# EAGLE design Driver (EAGLE 7.6.0)
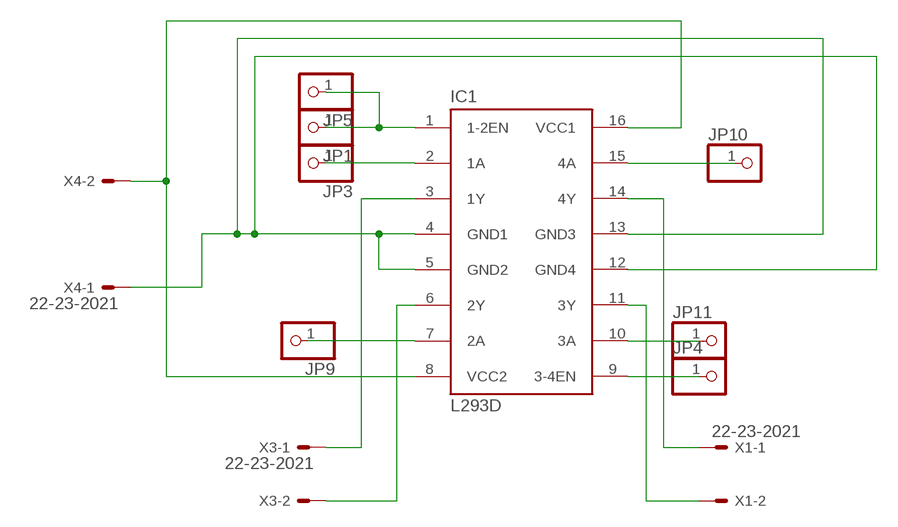
[diagram p0: schematic, sheet 1]

## Parts
IC1  L293D  [DIL16]
JP1  PINHD-1X1  [1X01]
JP3  PINHD-1X1  [1X01]
JP4  PINHD-1X1  [1X01]
JP5  PINHD-1X1  [1X01]
JP9  PINHD-1X1  [1X01]
JP10  PINHD-1X1  [1X01]
JP11  PINHD-1X1  [1X01]
X1  22-23-2021  [22-23-2021]
X3  22-23-2021  [22-23-2021]
X4  22-23-2021  [22-23-2021]

## Nets
N$1: IC1.14(4Y) X1.1
N$2: IC1.1(1-2EN) JP1.1 JP5.1
N$3: IC1.2(1A) JP3.1
N$4: IC1.7(2A) JP9.1
N$5: IC1.10(3A) JP11.1
N$6: IC1.11(3Y) X1.2
N$7: IC1.3(1Y) X3.1
N$8: IC1.6(2Y) X3.2
N$9: IC1.15(4A) JP10.1
N$10: IC1.4(GND1) IC1.5(GND2) IC1.12(GND4) IC1.13(GND3) X4.1
N$12: IC1.8(VCC2) IC1.16(VCC1) X4.2
N$13: IC1.9(3-4EN) JP4.1

## Library data of the parts
IC1 = st-microelectronics:L293D: PUSH-PULL 4 CHANNEL DRIVER; MPN: L293D; OC_FARNELL: 9589619; OC_NEWARK: 56P8249
JP1 JP3-JP5 JP9-JP11 = pinhead:PINHD-1X1: PIN HEADER
X1 X3 X4 = con-molex:22-23-2021: .100" (2.54mm) Center Header - 2 Pin; MF: MOLEX; MPN: 22-23-2021; OC_FARNELL: 1462926; OC_NEWARK: 25C3832

## Board
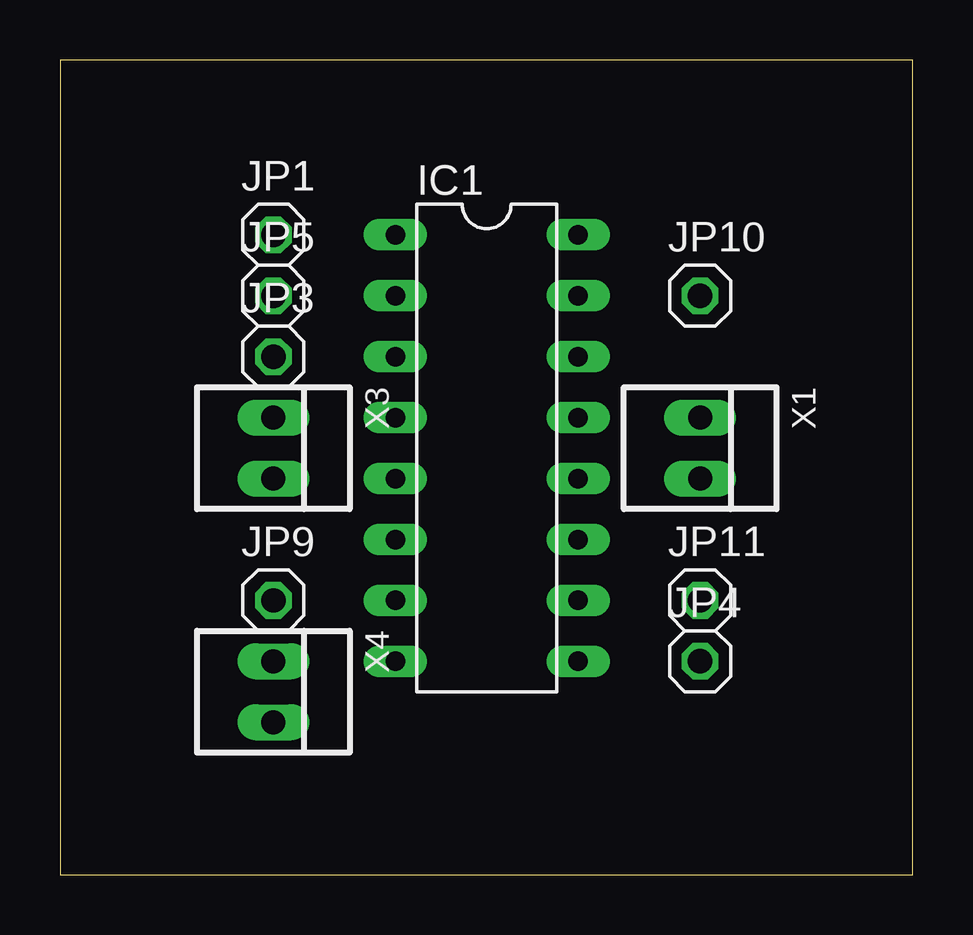
[diagram p1: board, top side]
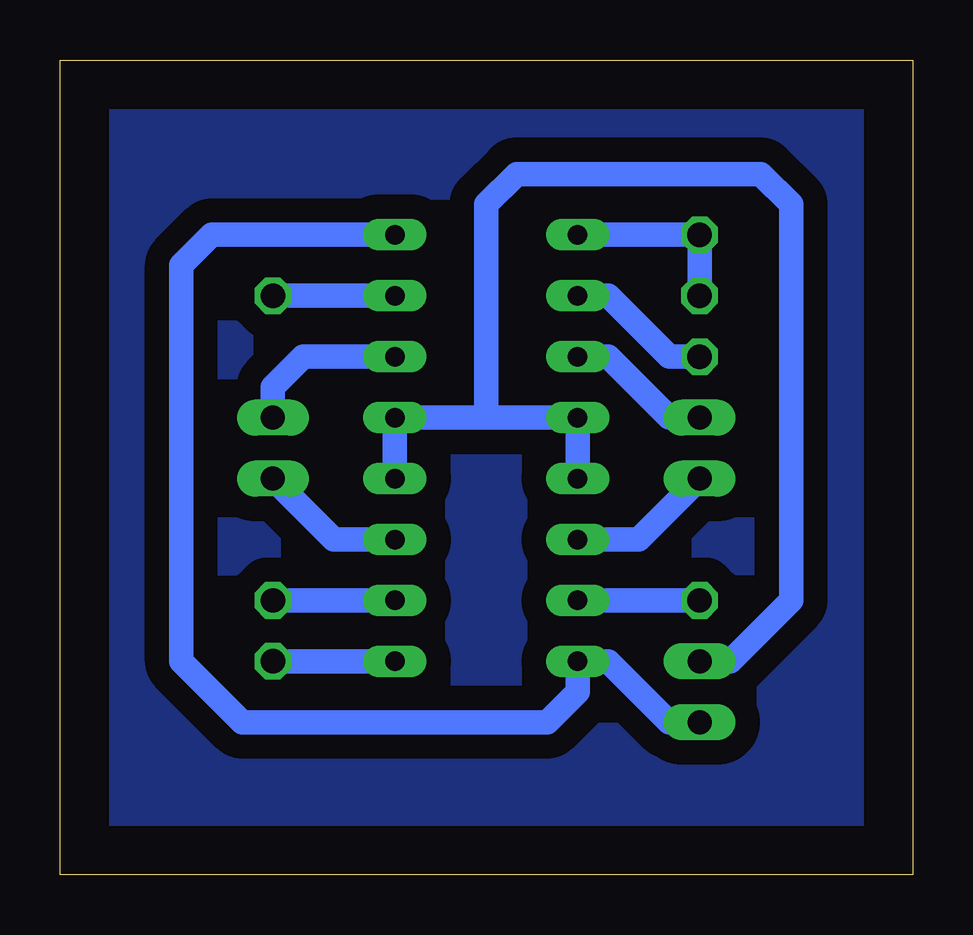
[diagram p2: board, bottom side, seen from below]

Size 35.54 x 33.96 mm. Coordinates in mm from the lower left corner, seen from the top.
Outline: 0,0 35.54,0 35.54,33.96 0,33.96 0,0
Copper layers (1*16): Top 0.035mm / dielectric 1.5mm / Bottom 0.035mm
Design rules "default *": minimum track width 50mil, minimum drill 24mil, track to track 18mil, track to pad 18mil, pad to pad 8mil, via to via 8mil, smd to smd 8mil, copper to edge 80mil, drill to drill 8mil, minimum pad ring 10mil, minimum via ring 8mil, stop-mask expansion 4mil, vias tented up to drill 0mil, thermal gap 10mil

### Footprints (pad centres in the part's own frame; a part is rotated, then mirrored left to right if it is on the bottom)
DIL16 = drill 0.813 long: 1 -8.89,-3.81; 2 -6.35,-3.81; 3 -3.81,-3.81; 4 -1.27,-3.81; 5 1.27,-3.81; 6 3.81,-3.81; 7 6.35,-3.81; 8 8.89,-3.81; 9 8.89,3.81; 10 6.35,3.81; 11 3.81,3.81; 12 1.27,3.81; 13 -1.27,3.81; 14 -3.81,3.81; 15 -6.35,3.81; 16 -8.89,3.81
1X01 = drill 1.016 octagon: 1 0,0
22-23-2021 = drill 1 long: 1 -1.27,0; 2 1.27,0

### Placement (x,y rotation side)
IC1  17.78,17.78 270 top
JP1  8.89,26.67 0 top
JP3  8.89,21.59 0 top
JP4  26.67,8.89 0 top
JP5  8.89,24.13 0 top
JP9  8.89,11.43 0 top
JP10  26.67,24.13 0 top
JP11  26.67,11.43 0 top
X1  26.67,17.78 270 top
X3  8.89,17.78 270 top
X4  8.89,7.62 270 top

### Tracks (layer width: path | path; a pad name or v marks a point on that pad's centre or on a via)
N$1
  Bottom 1.016: IC1.14 25.4,21.59 26.67,20.32 X1.1
N$2
  Bottom 1.016: IC1.1 JP1.1 JP5.1
N$3
  Bottom 1.016: JP3.1 10.16,21.59 12.7,24.13 IC1.2
N$4
  Bottom 1.016: JP9.1 IC1.7
N$5
  Bottom 1.016: IC1.10 JP11.1
N$6
  Bottom 1.016: IC1.11 24.13,13.97 X1.2
N$7
  Bottom 1.016: X3.1 10.16,19.05 12.7,21.59 IC1.3
N$8
  Bottom 1.016: X3.2 11.43,13.97 IC1.6
N$9
  Bottom 1.016: IC1.15 JP10.1
N$10
  Bottom 1.016: X4.1 7.62,8.89 5.08,11.43 5.08,27.94 6.35,29.21 16.51,29.21 17.78,27.94 17.78,19.05 | 17.78,19.05 IC1.4 IC1.5 | IC1.12 IC1.13 17.78,19.05
N$11
  pour Bottom (isolate 1.016): 0,34.29 35.56,34.29 35.56,0 0,0
N$12
  Bottom 1.016: X4.2 10.16,6.35 12.7,8.89 IC1.8 13.97,7.62 15.24,6.35 27.94,6.35 30.48,8.89 30.48,25.4 29.21,26.67 IC1.16
N$13
  Bottom 1.016: IC1.9 JP4.1